# Altium project Plytka_rozwojowa_ZCAD.PrjPcb (part 1 of 2)
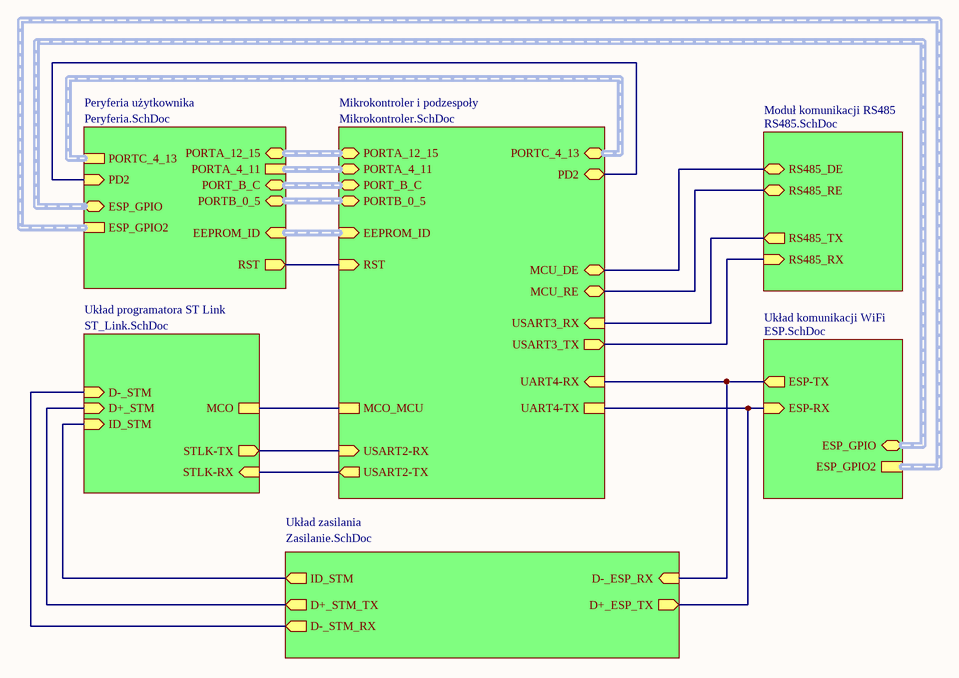
[diagram p0: Schemat_blokowy.SchDoc]
7 sheets, 200 parts. Net scope: hierarchical (ports join the sheet entries above them; power ports are global).
Board files: PCB1.PcbDoc, PCB2.PcbDoc
Sheets:
  Schemat_blokowy.SchDoc
    Mikrokontroler i podzespoły = Mikrokontroler.SchDoc
    Układ zasilania = Zasilanie.SchDoc
    Układ programatora ST Link = ST_Link.SchDoc
    Układ komunikacji WiFi = ESP.SchDoc
    Moduł komunikacji RS485 = RS485.SchDoc
    Peryferia użytkownika = Peryferia.SchDoc

## Sheet Schemat_blokowy.SchDoc: Płytka rozwojowa STM
size A4; Author1: Łukasz Wawrzyniak; Organization: Politechnika Łódzka; Address1: WEEIA; Address2: Elektronika i Telekomunikacja; Address3: Semestr zimowy 2021/2022; Address4: Stopień II; Revision: -; SheetNumber: 1; SheetTotal: 7; Author2: Mateusz Melka; Title2: Zaawansowane narzędzia CAD/EDA; Author5: Maciej Figiel; Author4: Michał Skurpel; Author3: Jakub Korzeniowski; Index1: 239499; Index2: 239488; Index3: 239436; Index4: 239457; Index5: 239473

### Sub-sheets
Mikrokontroler i podzespoły = Mikrokontroler.SchDoc: UART4-RX (in), USART2-RX (in), USART2-TX (out), MCO_MCU, USART3_RX (in), USART3_TX (out), MCU_RE (bidir), MCU_DE (bidir), PD2 (bidir), RST (in), UART4-TX, PORTA_4_11 (bidir, harness PORTA 4 11), PORTA_12_15 (bidir, harness PORTA 12 15), PORTC_4_13 (bidir, harness PORTC 4 13), PORT_B_C (bidir, harness PORT_B_C), EEPROM_ID (in, harness Wyprowadzenia adresowe EEPROM), PORTB_0_5 (bidir, harness PORTB 0 5)
Moduł komunikacji RS485 = RS485.SchDoc: RS485_TX (out), RS485_RX (in), RS485_DE (bidir), RS485_RE (bidir)
Peryferia użytkownika = Peryferia.SchDoc: RST (out), PD2 (in), ESP_GPIO (bidir, harness GPIO ESP), PORTB_0_5 (bidir, harness PORTB 0 5), PORT_B_C (bidir, harness PORT_B_C), PORTA_12_15 (bidir, harness PORTA 12 15), EEPROM_ID (in, harness Wyprowadzenia adresowe EEPROM), PORTA_4_11 (harness PORTA 4 11), PORTC_4_13 (harness PORTC 4 13), ESP_GPIO2 (harness GPIO ESP2)
Układ komunikacji WiFi = ESP.SchDoc: ESP-TX (out), ESP-RX (in), ESP_GPIO (bidir, harness GPIO ESP), ESP_GPIO2 (harness GPIO ESP2)
Układ programatora ST Link = ST_Link.SchDoc: D-_STM (in), D+_STM (in), ID_STM (in), MCO, STLK-TX (out), STLK-RX (in)
Układ zasilania = Zasilanie.SchDoc: ID_STM (out), D+_STM_TX (out), D-_STM_RX (out), D+_ESP_TX (out), D-_ESP_RX (in)

### Nets
PA2: sheet Mikrokontroler i podzespoły/USART2-TX, sheet Układ programatora ST Link/STLK-RX
PA3: sheet Mikrokontroler i podzespoły/USART2-RX, sheet Układ programatora ST Link/STLK-TX
PD2: sheet Mikrokontroler i podzespoły/PD2, sheet Peryferia użytkownika/PD2
RX_PORT: sheet Mikrokontroler i podzespoły/UART4-TX, sheet Układ zasilania/D+_ESP_TX, sheet Układ komunikacji WiFi/ESP-RX
TX_PORT: sheet Mikrokontroler i podzespoły/UART4-RX, sheet Układ zasilania/D-_ESP_RX, sheet Układ komunikacji WiFi/ESP-TX
NetC34_2: sheet Mikrokontroler i podzespoły/MCO_MCU, sheet Układ programatora ST Link/MCO
NetC64_1: sheet Mikrokontroler i podzespoły/RST, sheet Peryferia użytkownika/RST
NetCN1_4: sheet Układ zasilania/ID_STM, sheet Układ programatora ST Link/ID_STM
NetJ2_1: sheet Układ zasilania/D+_STM_TX, sheet Układ programatora ST Link/D+_STM
NetJ3_1: sheet Układ zasilania/D-_STM_RX, sheet Układ programatora ST Link/D-_STM
NetJ10_1: sheet Mikrokontroler i podzespoły/MCU_DE, sheet Moduł komunikacji RS485/RS485_DE
NetJ11_1: sheet Mikrokontroler i podzespoły/MCU_RE, sheet Moduł komunikacji RS485/RS485_RE
NetP2_2: sheet Mikrokontroler i podzespoły/USART3_RX, sheet Moduł komunikacji RS485/RS485_TX
NetP3_2: sheet Mikrokontroler i podzespoły/USART3_TX, sheet Moduł komunikacji RS485/RS485_RX

### Buses and harness runs
harness sheet Mikrokontroler i podzespoły/EEPROM_ID = sheet Peryferia użytkownika/EEPROM_ID
harness sheet Mikrokontroler i podzespoły/PORT_B_C = sheet Peryferia użytkownika/PORT_B_C
harness sheet Mikrokontroler i podzespoły/PORTA_4_11 = sheet Peryferia użytkownika/PORTA_4_11
harness sheet Mikrokontroler i podzespoły/PORTA_12_15 = sheet Peryferia użytkownika/PORTA_12_15
harness sheet Mikrokontroler i podzespoły/PORTB_0_5 = sheet Peryferia użytkownika/PORTB_0_5
harness sheet Mikrokontroler i podzespoły/PORTC_4_13 = sheet Peryferia użytkownika/PORTC_4_13
harness sheet Peryferia użytkownika/ESP_GPIO2 = sheet Układ komunikacji WiFi/ESP_GPIO2
harness sheet Peryferia użytkownika/ESP_GPIO = sheet Układ komunikacji WiFi/ESP_GPIO

### Notes on the sheet
- Title:
- Organisation:
- Authors:
- Size:
- Time:
- A4
- Number:
- Date:
- Revision:
- Sheet
- of
- File:

## Sheet Mikrokontroler.SchDoc: Płytka rozwojowa STM
size A3; Author1: Łukasz Wawrzyniak; Organization: Politechnika Łódzka; Address1: WEEIA; Address2: Elektronika i Telekomunikacja; Address3: Semestr zimowy 2021/2022; Address4: Stopień II; Revision: -; SheetNumber: 4; SheetTotal: 7; Author2: Mateusz Melka; Title2: Zaawansowane narzędzia CAD/EDA; Author3: Jakub Korzeniowski; Author4: Michał Skurpel; Author5: Maciej Figiel; Index1: 239499; Index2: 239488; Index3: 239436; Index4: 239457; Index5: 239473
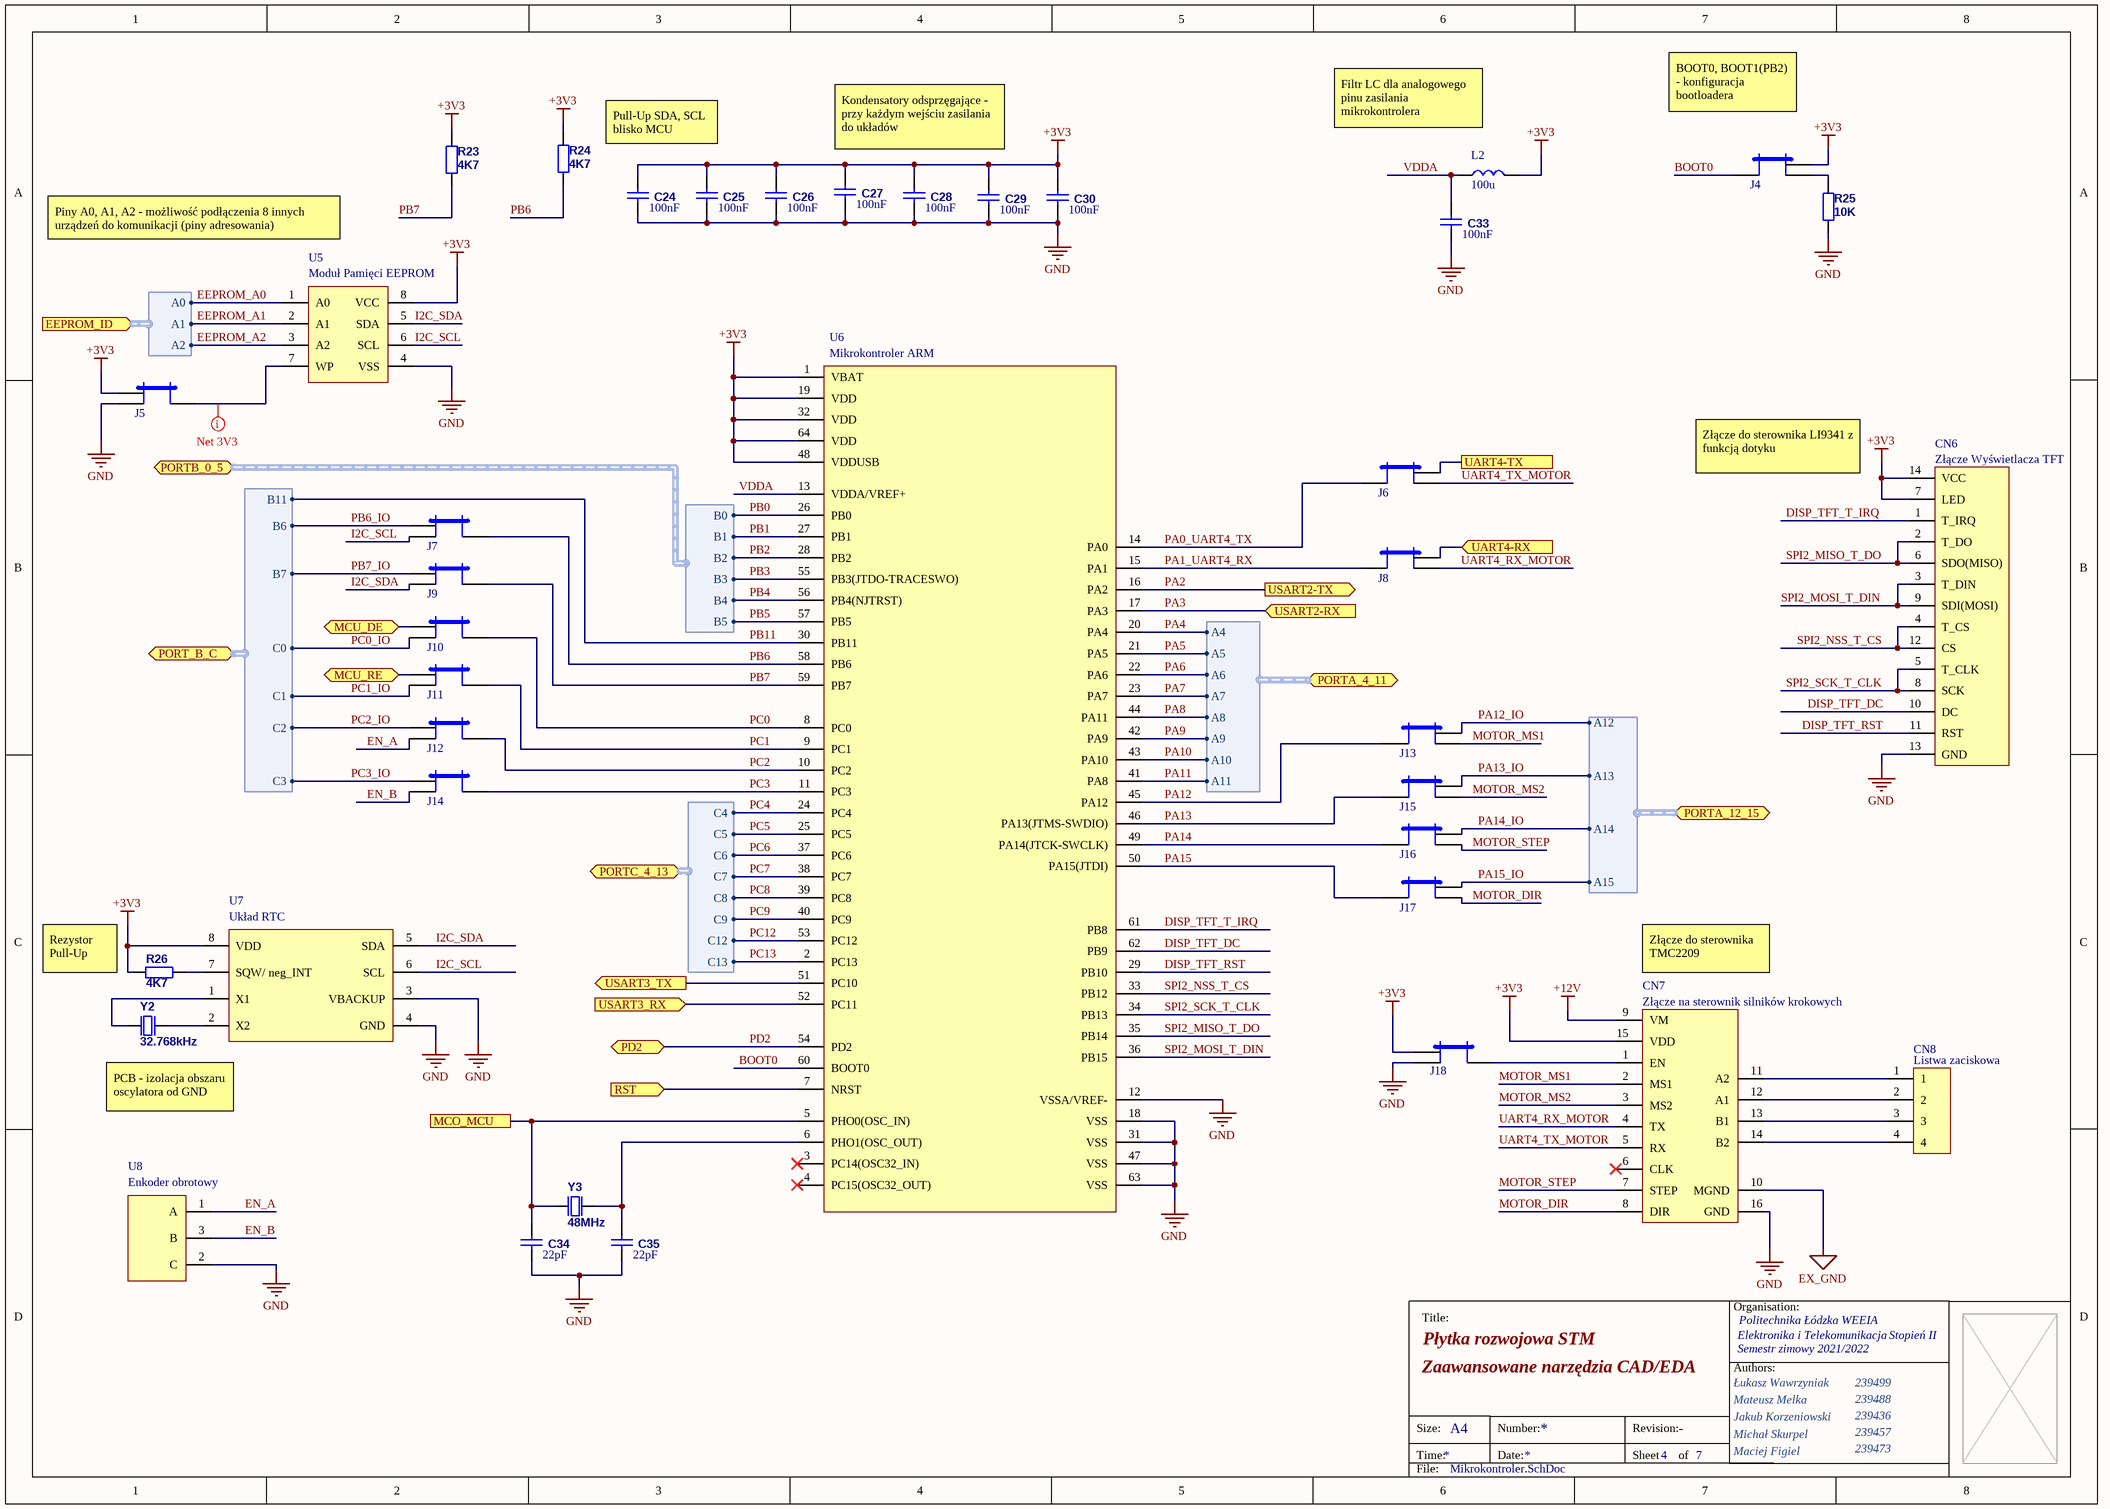
[diagram p1: Mikrokontroler.SchDoc]

### Parts
C24  100nF  [0805]
C25  100nF  [0805]
C26  100nF  [0805]
C27  100nF  [0805]
C28  100nF  [0805]
C29  100nF  [0805]
C30  100nF  [0805]
C33  100nF  [0805]
C34  22pF  [0805]
C35  22pF  [0805]
CN6  Złącze Wyświetlacza TFT  [Display_TFT_Socket_1x14_Raster_2_54mm]
CN7  Złącze na sterownik silników krokowych  [Step_motor_Socket_TMC2209]
CN8  Listwa zaciskowa  [TE_282836-4]
J4  Zworka  [Jumper_1x3_Raster_2_54mm]  (value not drawn)
J5  Zworka  [Jumper_1x3_Raster_2_54mm]  (value not drawn)
J6  Zworka  [Jumper_1x3_Raster_2_54mm]  (value not drawn)
J7  Zworka  [Jumper_1x3_Raster_2_54mm]  (value not drawn)
J8  Zworka  [Jumper_1x3_Raster_2_54mm]  (value not drawn)
J9  Zworka  [Jumper_1x3_Raster_2_54mm]  (value not drawn)
J10  Zworka  [Jumper_1x3_Raster_2_54mm]  (value not drawn)
J11  Zworka  [Jumper_1x3_Raster_2_54mm]  (value not drawn)
J12  Zworka  [Jumper_1x3_Raster_2_54mm]  (value not drawn)
J13  Zworka  [Jumper_1x3_Raster_2_54mm]  (value not drawn)
J14  Zworka  [Jumper_1x3_Raster_2_54mm]  (value not drawn)
J15  Zworka  [Jumper_1x3_Raster_2_54mm]  (value not drawn)
J16  Zworka  [Jumper_1x3_Raster_2_54mm]  (value not drawn)
J17  Zworka  [Jumper_1x3_Raster_2_54mm]  (value not drawn)
J18  Zworka  [Jumper_1x3_Raster_2_54mm]  (value not drawn)
L2  value 100u  [Coil_Raster_2mm]  (hidden comment: Coil)
R23  4K7  [0805]
R24  4K7  [0805]
R25  10K  [0805]
R26  4K7  [0805]
U5  Moduł Pamięci EEPROM  [SOIC127P794X203-8N]
U6  Mikrokontroler ARM  [QFP50P1200X1200X160-64N]
U7  Układ RTC  [SOP65P490X110-8N]
U8  Enkoder obrotowy  [Encoder_EC12E1220405]
Y2  32.768kHz  [HC49/4H]
Y3  48MHz  [HC49/4H]

### Ports
EEPROM_ID (in, harness Wyprowadzenia adresowe EEPROM), MCO_MCU, MCU_DE (bidir), MCU_RE (bidir), PD2 (bidir), PORT_B_C (bidir, harness PORT_B_C), PORTA_4_11 (bidir, harness PORTA 4 11), PORTA_12_15 (bidir, harness PORTA 12 15), PORTB_0_5 (bidir, harness PORTB 0 5), PORTC_4_13 (bidir, harness PORTC 4 13), RST (in), UART4-RX (in), UART4-TX, USART2-RX (in), USART2-TX (out), USART3_RX (in), USART3_TX (out)

### Harnesses
PORTC 4 13: C4, C5, C6, C7, C8, C9, C12, C13
Wyprowadzenia adresowe EEPROM: A0, A1, A2
PORTA 4 11: A4, A5, A6, A7, A8, A9, A10, A11
PORTB 0 5: B0, B1, B2, B3, B4, B5
PORTA 12 15: A12, A13, A14, A15
PORT_B_C: B6, B7, C0, C1, C2, C3, B11

### Nets
+3V3: C24.2 C25.2 C26.2 C27.2 C28.2 C29.2 C30.2 CN6.7(LED) CN6.14(VCC) CN7.15(VDD) J4.1 J5.1 J18.1 L2.1 R23.1 R24.1 R26.2 U5.8(VCC) U6.1(VBAT) U6.19(VDD) U6.32(VDD) U6.48(VDDUSB) U6.64(VDD) U7.8(VDD)  [project net ESP_VDDA43]
+12V: CN7.9(VM)
EX_GND: CN7.10(MGND)
GND: C24.1 C25.1 C26.1 C27.1 C28.1 C29.1 C30.1 C33.1 C34.1 C35.1 CN6.13(GND) CN7.16(GND) J5.3 J18.3 R25.2 U5.4(VSS) U6.12(VSSA/VREF-) U6.18(VSS) U6.31(VSS) U6.47(VSS) U6.63(VSS) U7.3(VBACKUP) U7.4(GND) U8.2(C)
BOOT0: J4.2 U6.60(BOOT0)
DISP_TFT_DC: CN6.10(DC) U6.62(PB9)
DISP_TFT_RST: CN6.11(RST) U6.29(PB10)
DISP_TFT_T_IRQ: CN6.1(T_IRQ) U6.61(PB8)
EEPROM_A0: U5.1(A0) ; port EEPROM_ID.A0  [project net EEPROM_0]
EEPROM_A1: U5.2(A1) ; port EEPROM_ID.A1  [project net EEPROM_1]
EEPROM_A2: U5.3(A2) ; port EEPROM_ID.A2  [project net EEPROM_2]
EN_A: J12.3 U8.1(A)
EN_B: J14.3 U8.3(B)
I2C_SCL: J7.3 U5.6(SCL) U7.6(SCL)
I2C_SDA: J9.3 U5.5(SDA) U7.5(SDA)
MOTOR_DIR: CN7.8(DIR) J17.3
MOTOR_MS1: CN7.2(MS1) J13.3
MOTOR_MS2: CN7.3(MS2) J15.3
MOTOR_STEP: CN7.7(STEP) J16.3
PA0_UART4_TX: J6.2 U6.14(PA0)
PA1_UART4_RX: J8.2 U6.15(PA1)
PA2: U6.16(PA2) ; port USART2-TX
PA3: U6.17(PA3) ; port USART2-RX
PA4: U6.20(PA4) ; port PORTA_4_11.A4
PA5: U6.21(PA5) ; port PORTA_4_11.A5
PA6: U6.22(PA6) ; port PORTA_4_11.A6
PA7: U6.23(PA7) ; port PORTA_4_11.A7
PA8: U6.44(PA11) ; port PORTA_4_11.A8
PA9: U6.42(PA9) ; port PORTA_4_11.A9
PA10: U6.43(PA10) ; port PORTA_4_11.A10
PA11: U6.41(PA8) ; port PORTA_4_11.A11
PA12: J13.2 U6.45(PA12)
PA12_IO: J13.1 ; port PORTA_12_15.A12
PA13: J15.2 U6.46(PA13(JTMS-SWDIO))
PA13_IO: J15.1 ; port PORTA_12_15.A13
PA14: J16.2 U6.49(PA14(JTCK-SWCLK))
PA14_IO: J16.1 ; port PORTA_12_15.A14
PA15: J17.2 U6.50(PA15(JTDI))
PA15_IO: J17.1 ; port PORTA_12_15.A15
PB0: U6.26(PB0) ; port PORTB_0_5.B0
PB1: U6.27(PB1) ; port PORTB_0_5.B1
PB2: U6.28(PB2) ; port PORTB_0_5.B2
PB3: U6.55(PB3(JTDO-TRACESWO)) ; port PORTB_0_5.B3
PB4: U6.56(PB4(NJTRST)) ; port PORTB_0_5.B4
PB5: U6.57(PB5) ; port PORTB_0_5.B5
PB6: J7.2 R24.2 U6.58(PB6)
PB6_IO: J7.1 ; port PORT_B_C.B6
PB7: J9.2 R23.2 U6.59(PB7)
PB7_IO: J9.1 ; port PORT_B_C.B7
PB11: U6.30(PB11) ; port PORT_B_C.B11
PC0: J10.2 U6.8(PC0)
PC0_IO: J10.3 ; port PORT_B_C.C0
PC1: J11.2 U6.9(PC1)
PC1_IO: J11.3 ; port PORT_B_C.C1
PC2: J12.2 U6.10(PC2)
PC2_IO: J12.1 ; port PORT_B_C.C2
PC3: J14.2 U6.11(PC3)
PC3_IO: J14.1 ; port PORT_B_C.C3
PC4: U6.24(PC4) ; port PORTC_4_13.C4
PC5: U6.25(PC5) ; port PORTC_4_13.C5
PC6: U6.37(PC6) ; port PORTC_4_13.C6
PC7: U6.38(PC7) ; port PORTC_4_13.C7
PC8: U6.39(PC8) ; port PORTC_4_13.C8
PC9: U6.40(PC9) ; port PORTC_4_13.C9
PC12: U6.53(PC12) ; port PORTC_4_13.C12
PC13: U6.2(PC13) ; port PORTC_4_13.C13
PD2: U6.54(PD2) ; port PD2
RX_PORT: J6.1 ; port UART4-TX
SPI2_MISO_T_DO: CN6.2(T_DO) CN6.6(SDO(MISO)) U6.35(PB14)
SPI2_MOSI_T_DIN: CN6.3(T_DIN) CN6.9(SDI(MOSI)) U6.36(PB15)
SPI2_NSS_T_CS: CN6.4(T_CS) CN6.12(CS) U6.33(PB12)
SPI2_SCK_T_CLK: CN6.5(T_CLK) CN6.8(SCK) U6.34(PB13)
TX_PORT: J8.1 ; port UART4-RX
UART4_RX_MOTOR: CN7.4(TX) J8.3
UART4_TX_MOTOR: CN7.5(RX) J6.3
VDDA: C33.2 L2.2 U6.13(VDDA/VREF+)
NetC34_2: C34.2 U6.5(PHO0(OSC_IN)) Y3.2(OSC2) ; port MCO_MCU
NetC35_2: C35.2 U6.6(PHO1(OSC_OUT)) Y3.1(OSC1)
NetC64_1: U6.7(NRST) ; port RST
NetCN7_1: CN7.1(EN) J18.2
NetCN7_11: CN7.11(A2) CN8.1
NetCN7_12: CN7.12(A1) CN8.2
NetCN7_13: CN7.13(B1) CN8.3
NetCN7_14: CN7.14(B2) CN8.4
NetJ4_3: J4.3 R25.1
NetJ5_2: J5.2 U5.7(WP)
NetJ10_1: J10.1 ; port MCU_DE
NetJ11_1: J11.1 ; port MCU_RE
NetP2_2: U6.52(PC11) ; port USART3_RX
NetP3_2: U6.51(PC10) ; port USART3_TX
NetR26_1: R26.1 U7.7(SQW/_neg_INT)
NetU7_1: U7.1(X1) Y2.2(OSC2)
NetU7_2: U7.2(X2) Y2.1(OSC1)

Not connected (* = marked no-connect by the designer): CN7 6(CLK)*; U6 3(PC14(OSC32_IN))* 4(PC15(OSC32_OUT))*

### Layout directives
net class Supply3V3: NetJ5_2

### Notes on the sheet
- (near J4) BOOT0, BOOT1(PB2) - konfiguracja bootloadera
- Pull-Up SDA, SCL
  blisko MCU
- Kondensatory odsprzęgające - przy każdym wejściu zasilania do układów
- (near L2) Filtr LC dla analogowego pinu zasilania mikrokontrolera
- Piny A0, A1, A2 - możliwość podłączenia 8 innych urządzeń do komunikacji (piny adresowania)
- Złącze do sterownika LI9341 z funkcją dotyku
- (near R26) Rezystor Pull-Up
- (near CN7) Złącze do sterownika TMC2209
- PCB - izolacja obszaru oscylatora od GND
- Title:
- Organisation:
- Authors:
- Size:
- Time:
- A4
- Number:
- Date:
- Revision:
- Sheet
- of
- File:

### Library data of the parts
C24-C30 C33-C35 = Cap: Ceramic capacitor MLCC SMD ±1%; ComponentLink1Description: datasheet; ComponentLink2Description: supplier
  C24-C30 C33: Value: 100nF
  C34 C35: Value: 22pF
CN6 = DISPLAY_TFT_Socket_1x14
CN7 = Step_motor_Socket_TMC2209
CN8 = Terminal_block_1x4: Model: 282836-4; Shop link: https://www.tme.eu/pl/details/282836-4/listwy-zaciskowe-do-druku/te-connectivity/; 3D model link: https://www.snapeda.com/parts/282836-4/TE%20Connectivity/view-part/?ref=search&t=282836-4
J4-J18 = Jumper1x3
L2 = Coil: Model: COIL0406-0.1; Shop link: https://www.tme.eu/pl/details/coil0406-0.1/dlawiki-pionowe/ferrocore/; Voltage: *; Prefered Voltage: *; Assembly type: THT; Quantity: *; User description: *; 3D model link: *
R23-R26 = Res: Resistor SMD  ±5%; Published: 19-Feb-2006; ComponentLink1Description: datasheet; ComponentLink2Description: supplier
  R23 R24 R26: Value: 4K7
  R25: Value: 10K
U5 = EEPROM_24LC512_I/SN: Model: 24LC512-I/SN; Shop link: https://www.tme.eu/pl/details/24lc512-i_sn/pamieci-eeprom-szeregowe/microchip-technology/; Value: *; Quantity: *; Voltage: *; Assembly type: SMD; Footprint link: https://www.snapeda.com/parts/24LC512-I/SN/Microchip%20Technology/view-part/?ref=search&t=%2024LC512-I%2FSN; 3D model link: https://www.snapeda.com/parts/24LC512-I/SN/Microchip%20Technology/view-part/?ref=search&t=%2024LC512-I%2FSN
U6 = ARM_Microcontroller_STM32L476RG: Model: STM32L476RGT6; Shop link: https://pl.mouser.com/ProductDetail/STMicroelectronics/STM32L476RGT6?qs=o58qnh%2FCpu44V%252B7CaDZzCA%3D%3D; Quantity: *; Voltage: *; Assembly type: SMD; Footprint link: https://www.snapeda.com/parts/STM32L476RGT6/STMicroelectronics/view-part/?ref=search&t=STM32L476RGT6; Value: *; 3D model link: https://www.st.com/en/microcontrollers-microprocessors/stm32l476rg.html#cad-resources
U7 = RTC_DS1339AU: Model: DS1339AU+; Shop link: https://www.tme.eu/pl/details/ds1339au+/uklady-rtc/analog-devices-maxim-integrated/; Quantity: *; Voltage: *; Assembly type: SMD; Footprint link: https://www.snapeda.com/parts/DS1339AU%2B/Maxim%20Integrated/view-part/?ref=search&t=DS1339AU%2B; Value: *; 3D model link: https://www.snapeda.com/parts/DS1339AU%2B/Maxim%20Integrated/view-part/?ref=search&t=DS1339AU%2B
U8 = Encoder_EC12E1220405: Shop link: https://www.tme.eu/pl/details/ec12e1220405/enkodery-inkrementalne/alps/; Footprint link: Own design; 3D model link: https://www.snapeda.com/parts/EC12E1220405/ALPS/view-part/?ref=search&t=EC12E1220405; Model: EC12E1220405
Y2 Y3 = XTAL_2PIN: Crystal Oscillator (20pF); ComponentLink1Description: datasheet; ComponentLink2Description: supplier; Value: *

## Sheet Zasilanie.SchDoc: Płytka rozwojowa STM
size A4; Author1: Łukasz Wawrzyniak; Organization: Politechnika Łódzka; Address1: WEEIA; Address2: Elektronika i Telekomunikacja; Address3: Semestr zimowy 2021/2022; Address4: Stopień II; Revision: -; SheetNumber: 2; SheetTotal: 7; Author2: Mateusz Melka; Title2: Zaawansowane narzędzia CAD/EDA; Author5: Maciej Figiel; Author4: Michał Skurpel; Author3: Jakub Korzeniowski; Index1: 239499; Index2: 239488; Index3: 239436; Index4: 239457; Index5: 239473
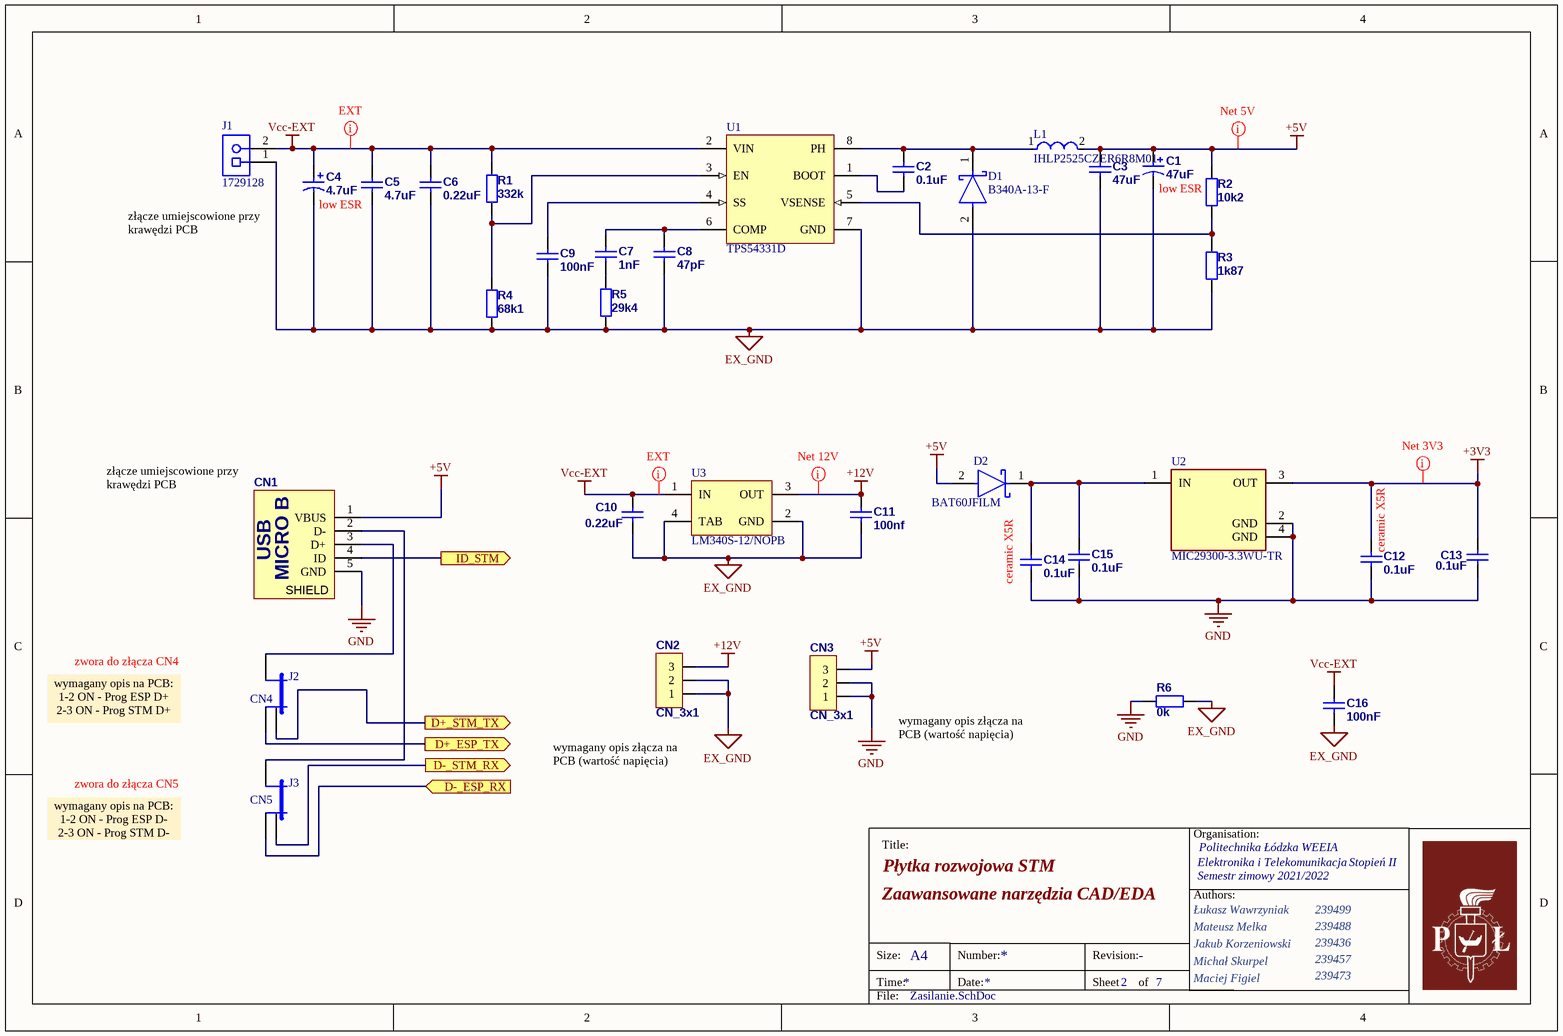
[diagram p2: Zasilanie.SchDoc]

### Parts
C1  value 47uF  [CES_C_5.3x5.3_5.4]
C2  value 0.1uF  [0805]
C3  value 47uF  [0805]
C4  value 4.7uF  [CES_C_5.3x5.3_5.4]
C5  value 4.7uF  [0805]
C6  value 0.22uF  [C1206]  (hidden comment: Cap)
C7  value 1nF  [0805]
C8  value 47pF  [0805]
C9  value 100nF  [0805]
C10  value 0.22uF  [0805]
C11  value 100nf  [0805]
C12  value 0.1uF  [0805]  (hidden comment: 10uF)
C13  value 0.1uF  [0805]  (hidden comment: 100n)
C14  value 0.1uF  [0805]  (hidden comment: 1uF)
C15  value 0.1uF  [0805]  (hidden comment: 100n)
C16  value 100nF  [0805]
CN1  473460001  [473460001]  (value not drawn)
CN2  CN_3x1  [GP_3x1_2mm]
CN3  CN_3x1  [GP_3x1_2mm]
D1  B340A-13-F  [FP-SMA-MFG]
D2  BAT60JFILM  [FP-BAT60JFILM-MFG]
J1  1729128  [PHOE-1729128-2_V]
J2  CN4  [Jumper_1x3_Raster_2_54mm]
J3  CN5  [Jumper_1x3_Raster_2_54mm]
L1  IHLP2525CZER6R8M01  [FP-IHLP-2525CZ-FP_2_413x3-MFG]
R1  value 332k  [0805]
R2  value 10k2  [0805]
R3  value 1k87  [0805]
R4  value 68k1  [0805]
R5  value 29k4  [0805]
R6  value 0k  [0805]
U1  TPS54331D  [D0008A_M]
U2  MIC29300-3.3WU-TR  [FP-TO263-3LD-PL-1-MFG]
U3  LM340S-12/NOPB  [KTT0003B_N]

### Ports
D+_ESP_TX (out), D+_STM_TX (out), D-_ESP_RX (in), D-_STM_RX (out), ID_STM (out)

### Nets
+3V3: C12.2 C13.2 U2.3(OUT)  [project net ESP_VDDA43]
+5V: C1.1 C3.2 CN1.1(VBUS) CN3.3 D2.2(A) L1.2 R2.2
+12V: C11.2 CN2.3 U3.3(OUT)
EX_GND: C1.2 C3.1 C4.2 C5.1 C6.1 C8.1 C9.1 C10.1 C11.1 C16.1 CN2.1 CN2.2 D1.2(A) J1.1 R3.1 R4.1 R5.1 R6.1 U1.7(GND) U3.2(GND) U3.4(TAB)
GND: C12.1 C13.1 C14.1 C15.1 CN1.5(GND) CN3.1 CN3.2 R6.2 U2.2(GND) U2.4(GND)
Vcc-EXT: C4.1 C5.2 C6.2 C10.2 C16.2 J1.2 R1.2 U1.2(VIN) U3.1(IN)
RX_PORT: J2.3 ; port D+_ESP_TX
TX_PORT: J3.3 ; port D-_ESP_RX
NetC2_1: C2.1 U1.1(BOOT)
NetC2_2: C2.2 D1.1(C) L1.1 U1.8(PH)
NetC7_1: C7.1 R5.2
NetC7_2: C7.2 C8.2 U1.6(COMP)
NetC9_2: C9.2 U1.4(SS)
NetC14_2: C14.2 C15.2 D2.1(K) U2.1(IN)
NetCN1_2: CN1.2(D-) J3.2
NetCN1_3: CN1.3(D+) J2.2
NetCN1_4: CN1.4(ID) ; port ID_STM
NetJ2_1: J2.1 ; port D+_STM_TX
NetJ3_1: J3.1 ; port D-_STM_RX
NetR1_1: R1.1 R4.2 U1.3(EN)
NetR2_1: R2.1 R3.2 U1.5(VSENSE)

Not connected (* = marked no-connect by the designer): CN1 S(SHIELD)

### Layout directives
net class Supply5V: +5V
net class Supply3V3: ESP_VDDA43
net class Supply12V: +12V
net class SupplyEXT: Vcc-EXT

### Notes on the sheet
- low ESR
- złącze umiejscowione przy krawędzi PCB
- (near C14) ceramic X5R
- (near C12) ceramic X5R
- wymagany opis na PCB:
  1-2 ON - Prog ESP D+
  2-3 ON - Prog STM D+
- zwora do złącza CN4
- zwora do złącza CN5
- (near CN2) wymagany opis złącza na PCB (wartość napięcia)
- wymagany opis złącza na PCB (wartość napięcia)
- wymagany opis na PCB:
  1-2 ON - Prog ESP D-
  2-3 ON - Prog STM D-
- Title:
- Organisation:
- Authors:
- Size:
- Time:
- A4
- Number:
- Date:
- Revision:
- Sheet
- of
- File:
- (in symbol 473460001) USB; MICRO B

### Library data of the parts
C1 C4 = Cap Pol: Polarized Capacitor SMD low ESR ±1%; ComponentLink1Description: datasheet; ComponentLink2Description: supplier
C2 C3 C5-C10 C12-C15 = Cap: Ceramic capacitor MLCC SMD ±5%; ComponentLink1Description: datasheet; ComponentLink2Description: supplier
C11 = Cap: Ceramic capacitor MLCC SMD ±5%; Voltage: 100VDC; ComponentLink1Description: datasheet; ComponentLink2Description: supplier
C16 = Cap: Ceramic capacitor MLCC SMD ±1%; Voltage: 100VDC; ComponentLink1Description: datasheet; ComponentLink2Description: supplier
CN1 = 473460001: Molex 473460001 microUSB Connector; Published: 20-Mar-2006; Supplier 1: Farnell; Supplier 2: TME; Supplier Part Number 1: 2426321; Supplier Part Number 2: MX-47346-0001; Shop link: TME: @MX-105017-0001
CN2 CN3 = CN_3x1: Goldpin type: male 2.54mm
D1 = CMP-1667-00003-3: DIODE SCHOTTKY 40V 3A SMA; Peak Non-Repetitive Surge Current: 80A; Polarity: Standard; Capacitance: 250pF; Forward Voltage: 500mV; Element Configuration: Single; Max Reverse Current: 500uA; Length: 4.6mm; Number of Pins: 2; Contact Plating: Tin; Min Operating Temperature: -55°C; Package Quantity: 5000; Max Reverse Voltage (DC): 40V; REACH SVHC: No SVHC; Voltage Rating (DC): 40V; Max Forward Surge Current (Ifsm): 80A; Average Rectified Current: 3A; Forward Current: 3A; Output Current: 3A; Height: 2.3mm; Current Rating: 3A; Voltage: 40V; Max Operating Temperature: 125°C; Packaging: Tape and Reel; Current: 3A; Termination: SMD/SMT; Radiation Hardening: No; Case/Package: SMA; Width: 2.92mm; Max Repetitive Reverse Voltage (Vrrm): 40V; Mount: Surface Mount; Weight: 0.002258oz; Lead Free: Lead Free; Series: -; RoHS Compliant: Yes
D2 = CMP-12187-000028-1: DIODE SCHOTTKY 10V 3A SOD323; Max Forward Surge Current (Ifsm): 5A; Forward Voltage: 580mV; Max Reverse Leakage Current: 7.5uA; Element Configuration: Single; Polarity: Standard; Contact Plating: Tin; Package Quantity: 1; Mount: Surface Mount; Min Operating Temperature: -65°C; Average Rectified Current: 3A; Packaging: Tape and Reel; Forward Current: 3A; Height: 1.07mm; Length: 1.8mm; REACH SVHC: No SVHC; Peak Non-Repetitive Surge Current: 5A; Max Surge Current: 5A; Width: 1.45mm; Current Rating: 3A; Lead Free: Lead Free; Radiation Hardening: No; Max Reverse Voltage (DC): 10V; Peak Reverse Current: 7.5uA; Max Operating Temperature: 150°C; Max Repetitive Reverse Voltage (Vrrm): 10V; Number of Pins: 2; Weight: 0.01lb; Output Current: 3A; Voltage Rating (DC): 10V
J1 = CMP-2000-05815-1: PCB Terminal Block, 13.5 A, 400 V, 2-Pin THD, RoHS, Bulk; Manufacturer: Phoenix Contact; Package Version: 03/2015; No. of Rows: 1; Pitch: 5.08mm; No. of Positions: 2; Current Rating: 13500mA; Voltage Rating: 400V; Manufacturer URL: http://www.phoenixcontact.com/; Datasheet URL: https://datasheet.ciiva.com/16046/1729128-16046181.pdf; RoHS: TRUE; Package URL: https://www.phoenixcontact.com/online/portal/pi/pxc/product_detail_page/!ut/p/b1/3VdJjqNKFDxLH8AFycySyWY2ozFsEPOMMQaDOX1XedGL_1Vdm5YXJleknhSKeBkvI6EA8ncAo3AYoDhBQGco6KN7VURTdemj9us_IEKEZo_YHiPAEWEFmDGOHMORkqKYCORBZxgL7ZoaZYcbFFUZ3fqxSY6GOuxydWUuHqz1ynmMFygu583Bob0Ewr6Sd_l-5m-kAueHiB0jpRwZwe58wwtkpxtMYd_LmGcDRU02dRNEyWt6Y2ti5pSyJ_reIkzIulrqApdnbT11V5jnCKbYNCvhEM1MCpPByat_X379-iThf08CI5GfOPqfBeS3BRoBOdD55AKVv0iLwCMq-2BrzXWSGRH7pUGD9uwXQjiph3xL0DKQwdGa0JImiIOmBNOestqgwTHSSs2oOep-78apyXQBvNi8ZLaFjvjWvcaUEBu0MC6Wbe-d6mB0FAebo2lUWinqYaZs5DAYzV0RP9yitUjnGJ0iI9xhZkT42OCQNUJJhkgWINNQLP2JFP6OpMg3JCVg70jqHT0lvKOnhHf0lPuOnnLf0VPuWx6_dxwUIvwk5WMkT0kLL1mh61l2yZVSzG3pYV_bqo-mj6uMKwKwdnnW8Jh5RTOJzMOA5c-eJDaZQw4mTMPH02PvS_ZAqNVjVTo2WyYLkwH_KU1mmmG5kjRhDqPXLwwVHvVOjCM60-fpXvTDfMGW1PVFVS1r4e4yVDk4ZdNbkUHvqPqQSeian4UD39fNKmachqdJ1NJbyk8rXT9mXTvPk3oE5meulKGgiruPJek-4I9hTT6G8ZLOyRSm2RRVbThERQad5OS28hdt4YW4vG0stgYYzsWsK4_7y6DZMjJSCqri1kyiZR5vD7pwIrNR7QwPHTcLTI5qT7eRlpHrdGiupYlqQDJ7zy_CND8fWWBoLRXxk1RVcXiBQwbTD4Xi7KL-FuO94t9xaqweXzH; PartNumber: 1729128; Package Description: 2-Pin Through Hole Device, Body 8.1 x 10.16 mm, Pitch 5.08 mm; Datasheet Version: 12/2013; Mounting Technology: ThroughHole; Orientation: Horizontal; Package Reference: 1729128-2; Packing: Bulk
J2 J3 = Jumper1x3
L1 = CMP-02424-000104-1: Commercial Inductors, High Saturation Series 6.8uH 4.5A 60mΩ 20%; Saturation Current: 8A; Self Resonant Frequency: 5MHz; Core Material: Metal; DC Resistance (DCR): 60mR; Test Frequency: 100kHz; Shielding: Shielded; Number of Pins: 2; Tolerance: 20%; Max DC Current: 8A; Max Operating Temperature: 125°C; Radiation Hardening: No; Inductance: 6.8uH; Contact Plating: Tin; RMS Current (Irms): 4.5A; Case/Package: 2525; Inductance Tolerance: 20%; Case Code (Metric): 6363; Lead Free: Lead Free; Package Quantity: 2000; Current Rating: 4.5A; Case Code (Imperial): 2525; Height - Seated (Max): 0.118inch; Height: 3mm; Mount: Surface Mount; Depth: 6.72mm; Military Standard: Not; Packaging: Tape and Reel; Min Operating Temperature: -55°C; Width: 0.255inch; Length: 7.24mm; Termination: SMD/SMT
R1-R5 = Res: Resistor SMD  ±1%; Published: 19-Feb-2006; ComponentLink1Description: datasheet; ComponentLink2Description: supplier
R6 = Res: Resistor SMD  ±5%; Published: 19-Feb-2006; ComponentLink1Description: datasheet; ComponentLink2Description: supplier
U1 = CMP-0323-00203-3: Buck Step Down Regulator with 3.5 to 28 V Input and 0.8 to 25 V Output, -40 to 150 degC, 8-Pin SOIC (D), Green (RoHS & no Sb/Br); Manufacturer: Texas Instruments; Regulated Outputs(#): 1; Vout(Min)(V): 0.8; Iout(Max)(A): 3; Vin(Min)(V): 3.5; Rating: Catalog; SubFamily: Step-Down Regulator; Vout(Max)(V): 25; Iq(Typ)(mA): 0.11; Vin(Max)(V): 28; Duty Cycle(Max)(%): 90; ComponentLink3Description: URL Link1; ComponentLink1URL: http://www.ti.com/general/docs/lit/getliterature.tsp?genericPartNumber=TPS54331&fileType=pdf; Code_JEDEC: MS-012AA; PartNumber: TPS54331D; PackageVersion: revM, Jun-2011; ComponentLink1Description: Datasheet; PackageReference: D0008A; Eco-Plan: Green (RoHS & no Sb/Br); PackageDescription: 8-Pin Plastic Small Outline Integrated Circuit, 4.9 x 3.9 mm, Pitch 1.27 mm Pitch; ComponentLink2URL: http://www.ti.com/litv/pdf/msoi002j; DatasheetVersion: SLVS839D; Topology: Buck; Switch Current Limit(Typ)(A): 3.5; ComponentLink3URL: Samples URL:http://www.ti.com/product/tps54331#samples; ComponentLink2Description: Package Specification; Mounting Technology: Surface Mount
U2 = CMP-06324-000026-1: IC REG LINEAR 3.3V 3A TO263-3; Dropout Voltage: 370mV; Number of Regulators: 1; Case/Package: TO-263-4; Lead Free: Lead Free; Min Operating Temperature: -40°C; Mount: Surface Mount; Packaging: Tape and Reel; Output Voltage: 3.3V; Max Operating Temperature: 125°C; Output Current: 3A
U3 = CMP-0062-00646-4: Series 3-Terminal Positive Regulators, 3-pin TO-263, Pb-Free; Manufacturer: Texas Instruments; PackageTopMarking: NSUZXYTTE#*LM340S*-12 P+; CompType: LDO IC; PowerWise: N; RoHS: Y; PackageDescription: TO-263, Molded, .400 x .390 x .180in, 3 Lead, .1in Pitch, Surface Mount; ComponentLink1URL: http://www.ti.com/general/docs/lit/getliterature.tsp?genericPartNumber=LM340&fileType=pdf; PinCount: 3; ComponentLink1Description: Datasheet URL; Code_JEDEC: MO-169-AA; PackageReference: KTT0003B

## Sheet ST_Link.SchDoc: Płytka rozwojowa STM
size A4; Author1: Łukasz Wawrzyniak; Organization: Politechnika Łódzka; Address1: WEEIA; Address2: Elektronika i Telekomunikacja; Address3: Semestr zimowy 2021/2022; Address4: Stopień II; Revision: -; SheetNumber: 3; SheetTotal: 7; Author2: Mateusz Melka; Title2: Zaawansowane narzędzia CAD/EDA; Author5: Maciej Figiel; Author4: Michał Skurpel; Author3: Jakub Korzeniowski; Index1: 239499; Index2: 239488; Index3: 239436; Index4: 239457; Index5: 239473
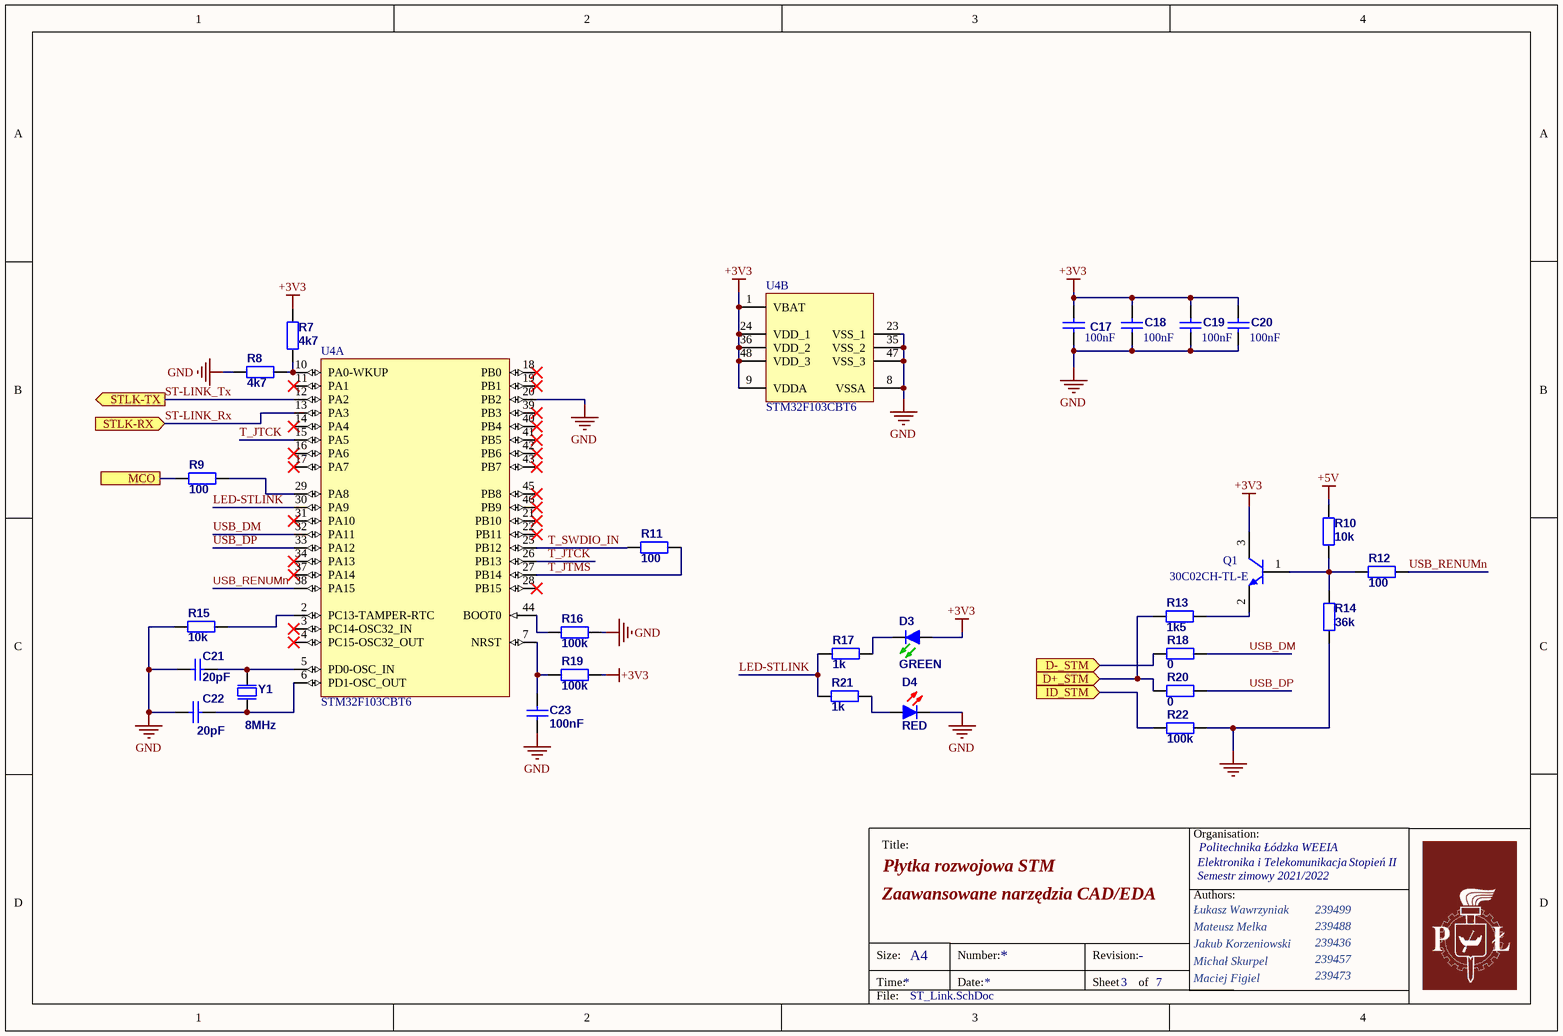
[diagram p3: ST_Link.SchDoc]

### Parts
C17  100nF  [0805]
C18  100nF  [0805]
C19  100nF  [0805]
C20  100nF  [0805]
C21  20pF  [0805]
C22  20pF  [0805]
C23  100nF  [0805]
D3  GREEN  [LED1206G]
D4  RED  [LED1206R]
Q1  30C02CH-TL-E  [ONSC-CPH-3_V]
R7  4k7  [0805]
R8  4k7  [0805]
R9  100  [0805]
R10  10k  [0805]
R11  100  [0805]
R12  100  [0805]
R13  1k5  [0805]
R14  36k  [0805]
R15  10k  [0805]
R16  100k  [0805]
R17  1k  [0805]
R18  0  [0805]
R19  100k  [0805]
R20  0  [0805]
R21  1k  [0805]
R22  100k  [0805]
U4  STM32F103CBT6  [STM-LQFP48_L]  (parts A,B of 2)
Y1  8MHz  [HC49/4H]

### Ports
D+_STM (in), D-_STM (in), ID_STM (in), MCO, STLK-RX (in), STLK-TX (out)

### Nets
+3V3: C17.2 C18.2 C19.2 C20.2 D3.1(A) Q1.3(C) R7.1 R19.1 U4.1(VBAT) U4.9(VDDA) U4.24(VDD_1) U4.36(VDD_2) U4.48(VDD_3)  [project net ESP_VDDA43]
+5V: R10.2
GND: C17.1 C18.1 C19.1 C20.1 C21.1 C22.1 C23.1 D4.2(K) R8.2 R14.2 R15.2 R16.1 R22.1 U4.8(VSSA) U4.20(PB2) U4.23(VSS_1) U4.35(VSS_2) U4.47(VSS_3)
LED-STLINK: R17.2 R21.2 U4.30(PA9)
ST-LINK_Rx: U4.13(PA3) ; port STLK-RX  [project net PA2]
ST-LINK_Tx: U4.12(PA2) ; port STLK-TX  [project net PA3]
T_JTCK: U4.15(PA5) U4.26(PB13)
T_JTMS: R11.1 U4.27(PB14)
T_SWDIO_IN: R11.2 U4.25(PB12)
USB_DM: R18.1 U4.32(PA11)
USB_DP: R20.1 U4.33(PA12)
USB_RENUMn: R12.2 U4.38(PA15)
NetC21_2: C21.2 U4.5(PD0-OSC_IN) Y1.2(OSC2)
NetC22_2: C22.2 U4.6(PD1-OSC_OUT) Y1.1(OSC1)
NetC23_2: C23.2 R19.2 U4.7(NRST)
NetC34_2: R9.2 ; port MCO
NetCN1_4: R22.2 ; port ID_STM
NetD3_2: D3.2(K) R17.1
NetD4_1: D4.1(A) R21.1
NetJ2_1: R13.2 R20.2 ; port D+_STM
NetJ3_1: R18.2 ; port D-_STM
NetQ1_1: Q1.1(B) R10.1 R12.1 R14.1
NetQ1_2: Q1.2(E) R13.1
NetR7_2: R7.2 R8.1 U4.10(PA0-WKUP)
NetR9_1: R9.1 U4.29(PA8)
NetR15_1: R15.1 U4.2(PC13-TAMPER-RTC)
NetR16_2: R16.2 U4.44(BOOT0)

Not connected (* = marked no-connect by the designer): U4 3(PC14-OSC32_IN)* 4(PC15-OSC32_OUT)* 11(PA1)* 14(PA4)* 16(PA6)* 17(PA7)* 18(PB0)* 19(PB1)* 21(PB10)* 22(PB11)* 28(PB15)* 31(PA10)* 34(PA13)* 37(PA14)* 39(PB3)* 40(PB4)* 41(PB5)* 42(PB6)* 43(PB7)* 45(PB8)* 46(PB9)*

### Notes on the sheet
- Title:
- Organisation:
- Authors:
- Size:
- Time:
- A4
- Number:
- Date:
- Revision:
- Sheet
- of
- File:

### Library data of the parts
C17-C22 = Cap: Ceramic capacitor MLCC SMD ±1%; ComponentLink1Description: datasheet; ComponentLink2Description: supplier
  C17-C20: Value: 100nF
  C21 C22: Value: 20pF
C23 = Cap: Ceramic capacitor MLCC SMD ±5%; ComponentLink1Description: datasheet; ComponentLink2Description: supplier; Value: 100nF
D3 = LED_GREEN: GREEN LED; Published: 04-Apr-2006
D4 = LED_RED: RED LED; Published: 04-Apr-2006
Q1 = CMP-1048-00073-1: Bipolar Transistor,, Low VCE(sat), NPN Single, 3-Pin CPH, Pb-Free, Tape and Reel; Manufacturer: On Semiconductor; IC Continuous (A): 0.7; Current: 0.7 A; Voltage: 30 V; PackageDescription: 3-Pin Small Outline Transistor, Body 2.9 x 1.6 mm, Pitch 0.95 mm; Mounting Technology: Surface Mount; ComponentLink3Description: Package Specification; ComponentLink2URL: http://www.onsemi.com/pub_link/Collateral/30C02CH-D.PDF; ComponentLink1Description: Manufacturer URL; ComponentLink2Description: Datasheet; Polarity: NPN; ComponentLink3URL: http://www.onsemi.com/pub_link/Collateral/50A02CH-D.PDF; ComponentLink1URL: http://www.onsemi.com/; PackageReference: CPH-3; RoHS: TRUE; PartNumber: 30C02CH-TL-E; Packing: Tape and Reel; Footprint: SC; Footprint model: https://octopart.com/30c02ch-tl-e-onsemi-20815499?r=sp#Specs; 3D model: https://octopart.com/30c02ch-tl-e-onsemi-20815499?r=sp#Specs; Shop link: Digi-Key: @30C02CH-TL-EOSTR-ND
R7-R22 = Res: Resistor SMD  ±5%; Published: 19-Feb-2006; ComponentLink1Description: datasheet; ComponentLink2Description: supplier
  R7 R8: Value: 4k7
  R9 R11 R12: Value: 100
  R10 R15: Value: 10k
  R13: Value: 1k5
  R14: Value: 36k
  R16 R19 R22: Value: 100k
  R17 R21: Value: 1k
  R18 R20: Value: 0
U4 = CMP-0237-00250-3: ARM Cortex-M3 32-bit MCU, 128 KB Flash, 20 KB Internal RAM, 37 I/Os, 48-pin LQFP, -40 to 85 degC, Tray; Supply Voltage(Vcc) min (V): 2; Operating Frequency(F) (Processor speed) (MHz): 72; A/D Converter: 2x12-bit (10 Channel); FLASH Size (Prog) (kB): 128; Internal RAM Size (kB): 20; I/Os (High Current): 37; Voltage: 3.3V; ComponentLink2Description: Datasheet; PackageReference: LQFP48; PartNumber: STM32F103CBT6; ComponentLink1Description: Manufacturer URL; DatasheetVersion: Rev. 16; PackageVersion: Rev. 6, 06/2013; Packing: Tray; ComponentLink1URL: http://www.st.com/web/en/home.html; Mounting Technology: Surface Mount; ComponentLink3URL: http://www.st.com/st-web-ui/static/active/en/resource/technical/document/datasheet/DM00058181.pdf; PackageDescription: 48-Pin Low Profile Quad Flat Package, 7 x 7 mm Body, 0.5 mm Pitch; Core: ARM Cortex-M3; ComponentLink3Description: Package Specification; ComponentLink2URL: http://www.st.com/st-web-ui/static/active/en/resource/technical/document/datasheet/CD00161566.pdf; Footprint: LQFP; Footprint model: https://octopart.com/stm32f103cbt6-stmicroelectronics-7868657?r=sp#Specs; 3D model: https://octopart.com/stm32f103cbt6-stmicroelectronics-7868657?r=sp#Specs; Shop link: Digi-Key: @497-6288-ND
Y1 = XTAL_2PIN: Crystal Oscillator (20pF); ComponentLink1Description: datasheet; ComponentLink2Description: supplier; Value: *

## Sheet ESP.SchDoc: Płytka rozwojowa STM
size A4; Author1: Łukasz Wawrzyniak; Organization: Politechnika Łódzka; Address1: WEEIA; Address2: Elektronika i Telekomunikacja; Address3: Semestr zimowy 2021/2022; Address4: Stopień II; Revision: -; SheetNumber: 6; SheetTotal: 7; Author2: Mateusz Melka; Title2: Zaawansowane narzędzia CAD/EDA; Author5: Maciej Figiel; Author4: Michał Skurpel; Author3: Jakub Korzeniowski; Index1: 239499; Index2: 239488; Index3: 239436; Index4: 239457; Index5: 239473
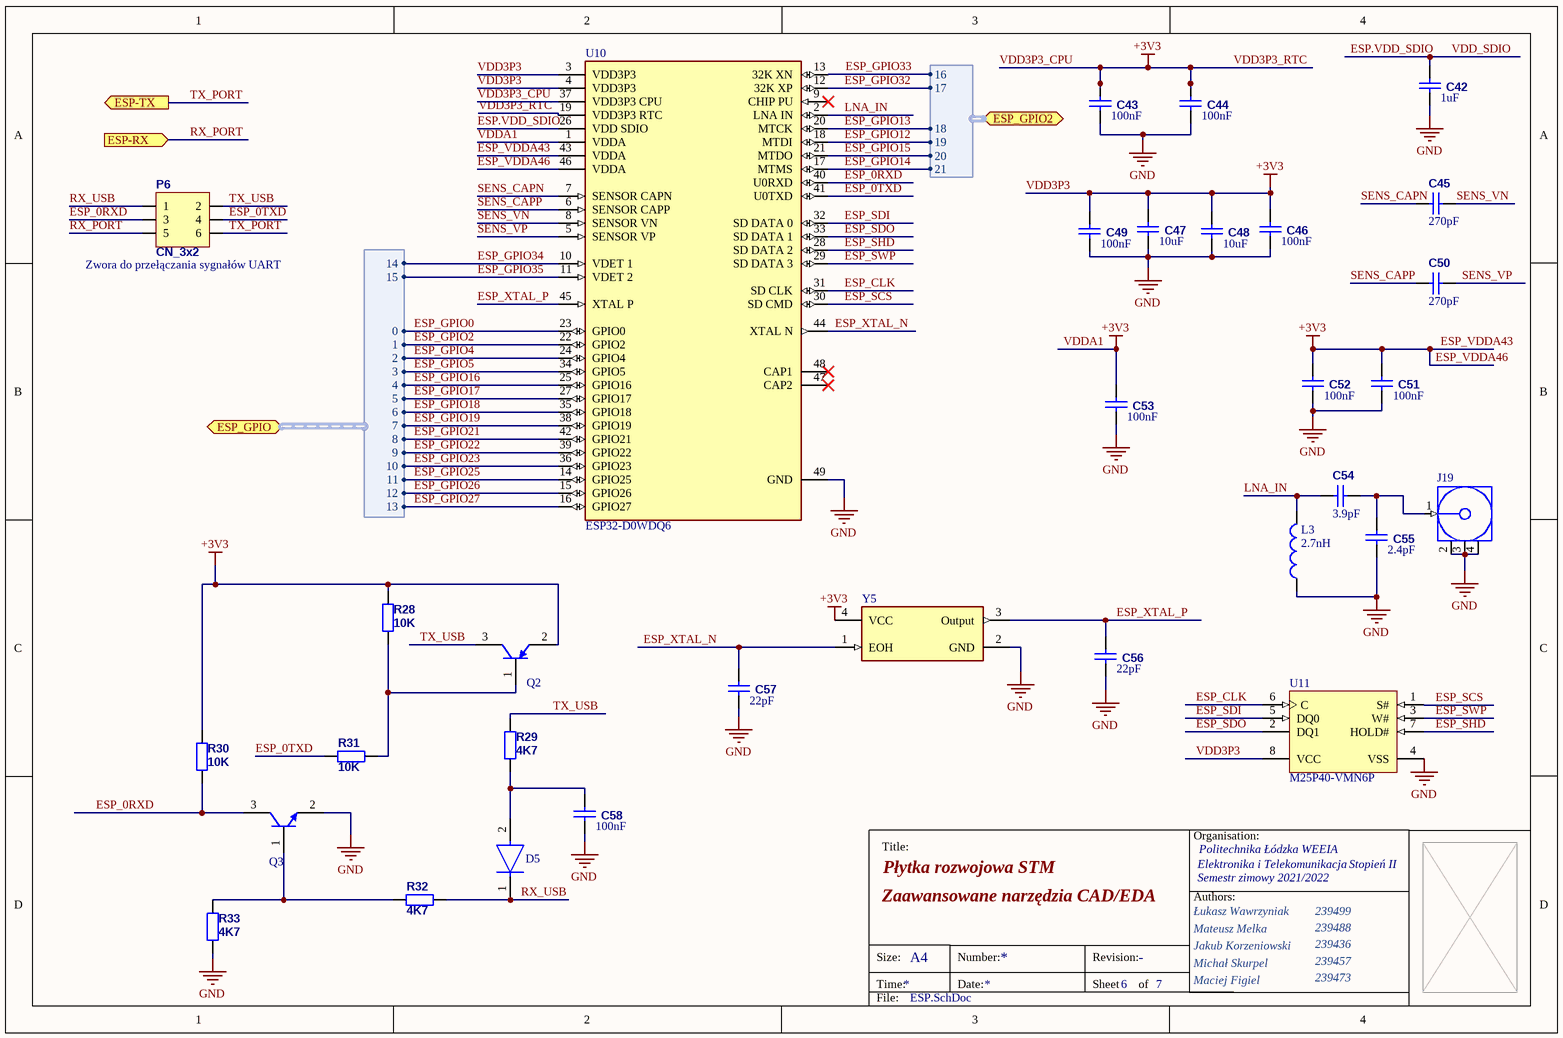
[diagram p4: ESP.SchDoc]

### Parts
C42  1uF  [0805]
C43  100nF  [0805]
C44  100nF  [0805]
C45  270pF  [0805]
C46  100nF  [0805]
C47  10uF  [0805]
C48  10uF  [0805]
C49  100nF  [0805]
C50  270pF  [0805]
C51  100nF  [0805]
C52  100nF  [0805]
C53  100nF  [0805]
C54  3.9pF  [0805]
C55  2.4pF  [0805]
C56  22pF  [0805]
C57  22pF  [0805]
C58  100nF  [0805]
D5  TME@1N4148WS  [FP-477AB-IPC_C]  (value not drawn)
J19  TME@908-22101T  [AMPH-908-22101_V]  (value not drawn)
L3  value 2.7nH  [0402-A]  (hidden comment: TME@0402AS-2N7K-08)
P6  CN_3x2  [GP_3x2]
Q2  TME@2SA1774G  [ONSC-SC-75-3-463-01_V]  (value not drawn)
Q3  TME@BC847ALT1G  [ONSC-SOT-23-3-318-08_V]  (value not drawn)
R28  10K  [0805]
R29  4K7  [0805]
R30  10K  [0805]
R31  10K  [0805]
R32  4K7  [0805]
R33  4K7  [0805]
U10  ESP32-D0WDQ6  [FP-ESP32-D0WDQ6-IPC_C]
U11  M25P40-VMN6P  [MICT-MN-8_N]
Y5  625L3C040M00000  [FP-625-MFG]  (value not drawn)

### Ports
ESP-RX (in), ESP-TX (out), ESP_GPIO2 (bidir, harness GPIO ESP2), ESP_GPIO (bidir, harness GPIO ESP)

### Harnesses
GPIO ESP: 0, 1, 2, 3, 4, 5, 6, 7, 8, 9, 10, 11, 12, 13, 14, 15
GPIO ESP2: 16, 17, 18, 19, 20, 21

### Nets
ESP_VDDA43: C43.2 C44.2 C46.2 C47.2 C48.2 C49.2 C51.2 C52.2 C53.2 Q2.2(E) R28.1 R30.1 U10.1(VDDA) U10.3(VDD3P3) U10.4(VDD3P3) U10.19(VDD3P3_RTC) U10.37(VDD3P3_CPU) U10.43(VDDA) U10.46(VDDA) U11.8(VCC) Y5.4(VCC)  [also labelled +3V3, ESP_VDDA46, VDD3P3, VDD3P3_CPU, VDD3P3_RTC, VDDA1]
GND: C42.1 C43.1 C44.1 C46.1 C47.1 C48.1 C49.1 C51.1 C52.1 C53.1 C55.1 C56.1 C57.1 C58.1 J19.2(GND) J19.3(GND) J19.4(GND) L3.1 Q3.2(E) R33.2 U10.49(GND) U11.4(VSS) Y5.2(GND)
ESP.VDD_SDIO: C42.2 U10.26(VDD_SDIO)  [also labelled VDD_SDIO]
ESP_0RXD: P6.3 Q3.3(C) R30.2 U10.40(U0RXD)
ESP_0TXD: P6.4 R31.1 U10.41(U0TXD)
ESP_CLK: U10.31(SD_CLK) U11.6(C)
ESP_GPIO0: U10.23(GPIO0) ; port ESP_GPIO.0
ESP_GPIO2: U10.22(GPIO2) ; port ESP_GPIO.1
ESP_GPIO4: U10.24(GPIO4) ; port ESP_GPIO.2
ESP_GPIO5: U10.34(GPIO5) ; port ESP_GPIO.3
ESP_GPIO12: U10.18(MTDI) ; port ESP_GPIO2.19
ESP_GPIO13: U10.20(MTCK) ; port ESP_GPIO2.18
ESP_GPIO14: U10.17(MTMS) ; port ESP_GPIO2.21
ESP_GPIO15: U10.21(MTDO) ; port ESP_GPIO2.20
ESP_GPIO16: U10.25(GPIO16) ; port ESP_GPIO.4
ESP_GPIO17: U10.27(GPIO17) ; port ESP_GPIO.5
ESP_GPIO18: U10.35(GPIO18) ; port ESP_GPIO.6
ESP_GPIO19: U10.38(GPIO19) ; port ESP_GPIO.7
ESP_GPIO21: U10.42(GPIO21) ; port ESP_GPIO.8
ESP_GPIO22: U10.39(GPIO22) ; port ESP_GPIO.9
ESP_GPIO23: U10.36(GPIO23) ; port ESP_GPIO.10
ESP_GPIO25: U10.14(GPIO25) ; port ESP_GPIO.11
ESP_GPIO26: U10.15(GPIO26) ; port ESP_GPIO.12
ESP_GPIO27: U10.16(GPIO27) ; port ESP_GPIO.13
ESP_GPIO32: U10.12(32K_XP) ; port ESP_GPIO2.17
ESP_GPIO33: U10.13(32K_XN) ; port ESP_GPIO2.16
ESP_GPIO34: U10.10(VDET_1) ; port ESP_GPIO.14
ESP_GPIO35: U10.11(VDET_2) ; port ESP_GPIO.15
ESP_SCS: U10.30(SD_CMD) U11.1(S#)
ESP_SDI: U10.32(SD_DATA_0) U11.5(DQ0)
ESP_SDO: U10.33(SD_DATA_1) U11.2(DQ1)
ESP_SHD: U10.28(SD_DATA_2) U11.7(HOLD#)
ESP_SWP: U10.29(SD_DATA_3) U11.3(W#)
ESP_XTAL_N: C57.2 U10.44(XTAL_N) Y5.1(EOH)
ESP_XTAL_P: C56.2 U10.45(XTAL_P) Y5.3(Output)
LNA_IN: C54.2 L3.2 U10.2(LNA_IN)
RX_PORT: P6.5 ; port ESP-RX
RX_USB: D5.1(C) P6.1 R32.2
SENS_CAPN: C45.2 U10.7(SENSOR_CAPN)
SENS_CAPP: C50.2 U10.6(SENSOR_CAPP)
SENS_VN: C45.1 U10.8(SENSOR_VN)
SENS_VP: C50.1 U10.5(SENSOR_VP)
TX_PORT: P6.6 ; port ESP-TX
TX_USB: P6.2 Q2.3(C) R29.1
NetC54_1: C54.1 C55.2 J19.1(SIGNAL)
NetC58_2: C58.2 D5.2(A) R29.2
NetQ2_1: Q2.1(B) R28.2 R31.2
NetQ3_1: Q3.1(B) R32.1 R33.1

Not connected (* = marked no-connect by the designer): U10 9(CHIP_PU)* 47(CAP2)* 48(CAP1)*

### Notes on the sheet
- (near P6) Zwora do przełączania sygnałów UART
- Title:
- Organisation:
- Authors:
- Size:
- Time:
- A4
- Number:
- Date:
- Revision:
- Sheet
- of
- File:

### Library data of the parts
C42 C45 C47 C48 C50 C54-C57 = Cap: Ceramic capacitor MLCC SMD ±1%; Value: 100nF; ComponentLink1Description: datasheet; ComponentLink2Description: supplier
C43 C44 C46 C49 C51-C53 C58 = Cap: Ceramic capacitor MLCC SMD ±1%; ComponentLink1Description: datasheet; ComponentLink2Description: supplier; Value: 100nF
D5 = CMP-07163-000040-1: DIODE GEN PURP 75V 150MA SOD323F; Forward Voltage: 1V; Power Dissipation: 200mW; Element Configuration: Single; Max Forward Surge Current (Ifsm): 2A; Peak Reverse Current: 5uA; Recovery Time: 4ns; Package Quantity: 1; Number of Pins: 2; Height: 1mm; REACH SVHC: No SVHC; Max Reverse Voltage (DC): 75V; Forward Current: 150mA; Length: 1.8mm; Max Repetitive Reverse Voltage (Vrrm): 75V; Max Operating Temperature: 150°C; Average Rectified Current: 150mA; Contact Plating: Tin; Packaging: Tape and Reel; Radiation Hardening: No; Min Operating Temperature: -55°C; Width: 1.35mm; Weight: 0.0276g; Lead Free: Lead Free; Mount: Surface Mount; Reverse Voltage: 75V; Reverse Recovery Time: 4ns; ComponentLink1Description: TME; ComponentLink1URL: https://www.tme.eu/en/details/1n4148ws/smd-universal-diodes/onsemi/
J19 = CMP-2000-05707-1: Female MMCX Connector, 1 Position, Height 3.607 mm, -40 to 90 degC, RoHS, Bulk; Manufacturer: Amphenol; Impedance: 50Ohm; Body Material: BerylliumCopper; Shield Termination: Solder; Body Finish: Gold; Frequency - Max: 6GHz; Connector Type: Jack,FemaleSocket; Other Names: 90822101ARF1724; Dielectric Material: LiquidCrystalPolymer(LCP); Online Catalog: MMCX,MicroMate™Series; 3D Model: 908-22101.igs; Fastening Type: Snap-On; Connector Style: MMCX; Standard Package: 1; Manufacturer URL: http://www.amphenol.com/; Series: MicroMate™; Mounting Type: SurfaceMount; Housing Color: Black; Operating Temperature: -55°C~155°C; Package Reference: 908-22101; Packaging: Bulk; Voltage Rating: -; Cable Group: -; Features: -; Datasheet URL: http://www.amphenolrf.com/downloads/dl/file/id/2664/product/2399/908_22101_customer_drawing.pdf; Center Contact Material: BerylliumCopper; Package Description: Female MMCX Connector, 1 Position, Height 3.607 mm; Center Contact Plating: Gold; Category: Connectors,Interconnects; Mounting Technology: SurfaceMount; Contact Termination: Solder; Ingress Protection: -; Datasheet Version: Rev. A, 05/1997; Family: CoaxialConnectors(RF); ComponentLink1Description: TME; ComponentLink1URL: https://www.tme.eu/pl/details/908-22101t/zlacza-mcx-mmcx/amphenol-icc/
L3 = Inductor: 0402; Code_IEC: 1005; Published: 8-Jun-2000; LatestRevisionDate: 29-May-2009; LatestRevisionNote: IPC-7351 Footprint Added.; PackageReference: 0402-A; Publisher: Altium Limited; PackageDescription: Chip Inductor; Code_JEITA: 0402; ComponentLink1Description: New link; ComponentLink1URL: https://www.tme.eu/pl/details/0402as-2n7k-08/dlawiki-smd-0402/fastron/
Q2 = CMP-1048-00415-1: PNP Silicon General Purpose Amplifier Transistor, 3-Pin SC-75, Pb-Free, Tape and Reel; Manufacturer: On Semiconductor; IC Continuous (A): -0.1; ComponentLink2URL: http://www.onsemi.com/pub_link/Collateral/2SA1774-D.PDF; Mounting Technology: Surface Mount; PartNumber: 2SA1774G; ComponentLink2Description: Datasheet; PackageDescription: 3-Pin Small Outline Transistor, Body 1.6 x 0.8 mm, Pitch 0.5 mm; RoHS: TRUE; Packing: Tape and Reel; PackageVersion: Rev. F, 07/2005; ComponentLink1URL: http://www.onsemi.com/; ComponentLink3Description: Package Specification; ComponentLink3URL: http://www.onsemi.com/pub_link/Collateral/463-01.PDF; ComponentLink1Description: Manufacturer URL; Polarity: PNP; DatasheetVersion: Rev. 9; PackageReference: SC-75-3-463-01; ComponentLink4Description: TME; ComponentLink4URL: https://www.tme.eu/en/details/2sa1774g/pnp-smd-transistors/onsemi/
Q3 = CMP-1048-00763-1: General Purpose Transistor, NPN Silicon, 3-Pin SOT-23, Pb-Free, Tape and Reel; Manufacturer: On Semiconductor; IC Continuous (A): 0.1; fT Min (MHz): 100; Mounting Technology: Surface Mount; ComponentLink1Description: Manufacturer URL; PackageDescription: 3-Pin Small Outline Transistor, Body 2.92 x 1.3 mm, Pitch 0.95 mm; PartNumber: BC847ALT1G; PackageVersion: Rev. AP, 11/2009; ComponentLink3Description: Package Specification; DatasheetVersion: Rev. 11; ComponentLink1URL: http://www.onsemi.com/; PackageReference: SOT-23-3-318-08; ComponentLink2Description: Datasheet; Packing: Tape and Reel; Polarity: NPN; ComponentLink3URL: http://www.onsemi.cn/pub_link/Collateral/318-08.PDF; RoHS: TRUE; ComponentLink2URL: http://www.onsemi.cn/pub_link/Collateral/BC846ALT1-D.PDF; ComponentLink4Description: TME; ComponentLink4URL: https://www.tme.eu/en/details/bc847alt1g/npn-smd-transistors/onsemi/
R28-R33 = Res: Resistor SMD  ±5%; Published: 19-Feb-2006; ComponentLink1Description: datasheet; ComponentLink2Description: supplier
  R28 R30 R31: Value: 10K
  R29 R32 R33: Value: 4K7
U10 = CMP-194065-000007-1: IC RF TXRX+MCU BLUETOOTH 48VFQFN; Memory Size: 520KB; Current - Receiving: 100mA; Current - Transmitting: 240mA; Interface: I2C; Sensitivity: -98dBm; Frequency: 2.4GHz; Data Rate: 150Mbps; Number of GPIO: 34; Min Operating Temperature: -40°C; Max Operating Temperature: 125°C; Packaging: Tape and Reel
U11 = CMP-0357-00072-1: 4 Mb (x1) Serial NOR Flash Memory, 75 MHz, 2.3 to 3.6 V, 8-pin SO8 Narrow (MN), Tube; Manufacturer: Micron; Part Family: M25PÂ; Speed: 75 MHzÂ; Density: 4MbÂ; Voltage: 2.3V-3.6VÂ; PackageDescription: 8-Pin SO Narrow, 3.9 X 4.9 mm, Pitch 1.27 mm; ComponentLink2URL: http://www.micron.com/~/media/Documents/Products/Data%20Sheet/NOR%20Flash/Serial%20NOR/M25P/M25P40.pdf; Part Status: ProductionÂ; Package: SO8 NarrowÂ; RoHS: YesÂ; PackageReference: MICT-MN-8; Mounting Technology: Surface Mount; Type: Data StorageÂ; DatasheetVersion: Rev. Y; ComponentLink2Description: Datasheet; PartNumber: M25P40-VMN6P; Width: x1Â; ComponentLink1URL: http://www.micron.com/; ComponentLink3Description: Package Specification; Applications: EmbeddedÂ; ComponentLink1Description: Manufacturer URL; PackageVersion: Rev 11; ComponentLink3URL: http://www.micron.com/~/media/Documents/Products/Data%20Sheet/NOR%20Flash/Serial%20NOR/M25P/M25P05A.pdf
Y5 = CMP-06858-000003-1: XTAL OSC XO 40.0000MHZ CMOS SMD; Max Supply Current: 15mA; Frequency: 40MHz; Frequency Stability: 50ppm; Min Supply Voltage: 2.97V; Max Supply Voltage: 3.63V; Load Capacitance: 15pF; Operating Supply Voltage: 3.3V; Min Operating Temperature: -10°C; Length: 2.5mm; Radiation Hardening: No; Max Operating Temperature: 70°C; Depth: 2mm; Mount: Surface Mount; Height: 0.039inch; Packaging: Tape and Reel; Case/Package: CSMD; Termination: SMD/SMT; Package Quantity: 3000; Contact Plating: Gold; Width: 0.079inch

## Sheet RS485.SchDoc: Płytka rozwojowa STM
size A4; Author1: Łukasz Wawrzyniak; Organization: Politechnika Łódzka; Address1: WEEIA; Address2: Elektronika i Telekomunikacja; Address3: Semestr zimowy 2021/2022; Address4: Stopień II; Revision: -; SheetNumber: 5; SheetTotal: 7; Author2: Mateusz Melka; Title2: Zaawansowane narzędzia CAD/EDA; Author5: Maciej Figiel; Author4: Michał Skurpel; Author3: Jakub Korzeniowski; Index1: 239499; Index2: 239488; Index3: 239436; Index4: 239457; Index5: 239473
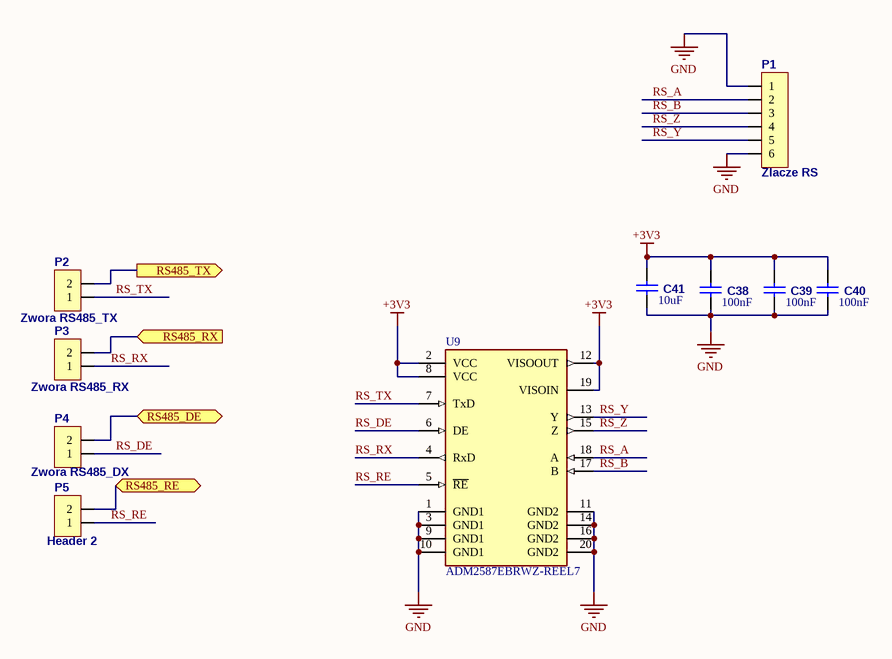
[diagram p5: RS485.SchDoc]

### Parts
C38  100nF  [0805]
C39  100nF  [0805]
C40  100nF  [0805]
C41  10uF  [0805]
P1  Zlacze RS  [GP_6x1]
P2  Zwora RS485_TX  [GP_2x1_2mm]
P3  Zwora RS485_RX  [GP_2x1_2mm]
P4  Zwora RS485_DX  [GP_2x1_2mm]
P5  Header 2  [GP_2x1_2mm]
U9  ADM2587EBRWZ-REEL7  [FP-RW-20-IPC_C]

### Ports
RS485_DE (bidir), RS485_RE (bidir), RS485_RX (in), RS485_TX (out)

### Nets
+3V3: C38.2 C39.2 C40.2 C41.2 U9.2(VCC) U9.8(VCC) U9.12(VISOOUT) U9.19(VISOIN)  [project net ESP_VDDA43]
GND: C38.1 C39.1 C40.1 C41.1 P1.1 P1.6 U9.1(GND1) U9.3(GND1) U9.9(GND1) U9.10(GND1) U9.11(GND2) U9.14(GND2) U9.16(GND2) U9.20(GND2)
RS_A: P1.2 U9.18(A)
RS_B: P1.3 U9.17(B)
RS_DE: P4.1 U9.6(DE)
RS_RE: P5.1 U9.5(~{RE})
RS_RX: P3.1 U9.4(RxD)
RS_TX: P2.1 U9.7(TxD)
RS_Y: P1.5 U9.13(Y)
RS_Z: P1.4 U9.15(Z)
NetJ10_1: P4.2 ; port RS485_DE
NetJ11_1: P5.2 ; port RS485_RE
NetP2_2: P2.2 ; port RS485_TX
NetP3_2: P3.2 ; port RS485_RX

### Notes on the sheet
- Title:
- Organisation:
- Authors:
- Size:
- Time:
- A4
- Number:
- Date:
- Revision:
- Sheet
- of
- File:

### Library data of the parts
C38-C40 = Cap: Ceramic capacitor MLCC SMD ±1%; ComponentLink1Description: datasheet; ComponentLink2Description: supplier; Value: 100nF
C41 = Cap: as C42 on sheet ESP; ComponentLink1Description: datasheet; ComponentLink2Description: supplier
P1 = CN_6x1
P2-P5 = CN_2x1
U9 = CMP-09096-000011-1: DGTL ISO RS422/RS485 20SOIC TME@ADM2587EBRWZ-REEL7; Manufacturer: Analog Devices; Min Supply Voltage: 3.3V; Simplex Duplex: Full Duplex; Nominal Supply Current: 72-125mA; Data Rate: 500kbits/s; Number Of Receivers: 1; Interface: RS-485,RS-422; Max Supply Voltage: 5V; Standoff Height: 0.1mm; Package: RW-20; ComponentLink2Description: Datasheet; Digikey Description: DGTL ISO RS422/RS485 20SOIC; Ipc Land Pattern Name: SOIC127P1032X250-20; Automotive: No; Octopart: https://octopart.com/adm2587ebrwz-reel7-analog+devices-12809043; Device Class L3: RS-232 / RS-422 / RS-485 Interface ICs; Temperature: -40°C to +85°C; Lead Free: Yes; ComponentLink2URL: https://www.analog.com/media/en/technical-documentation/data-sheets/adm2582e_2587e.pdf; RoHS: TRUE; Manufacturer Part Number: ADM2587EBRWZ-REEL7; Temperature Range Low: -40°C; Height: 2.65mm; Temperature Range High: +85°C; Mouser Description: Digital Isolators 2.5kV Sgnl & Pwr Iso Full/Hlf Duplx; Device Class L2: Interface ICs; Device Class L1: Integrated Circuits (ICs); Number Of Transmitters: 1; Category: IC; ComponentLink3Description: TME; ComponentLink3URL: https://www.tme.eu/pl/details/adm2587ebrwz-reel7/uklady-scalone-interfejs-rs232-422-485/analog-devices/